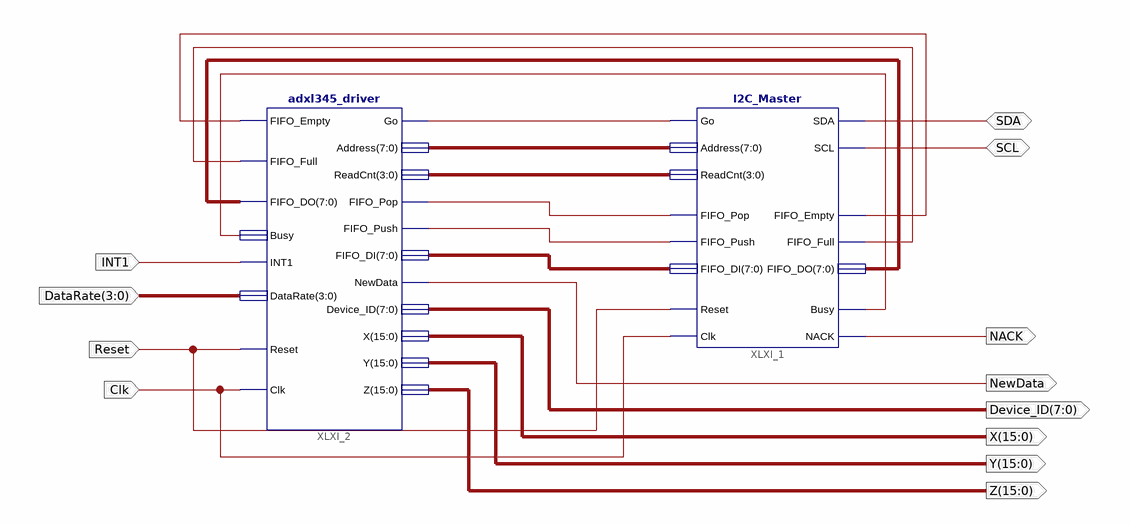
[diagram p0: schematic sheet 1]
// Xilinx ISE schematic adxl345_i2c.sch (spartan3e) as structural Verilog: 2 symbols, 12 ports
module adxl345_i2c (
  input  [3:0] DataRate,
  input  Reset,
  input  Clk,
  input  INT1,
  inout  SDA,
  inout  SCL,
  output NACK,
  output NewData,
  output [7:0] Device_ID,
  output [15:0] X,
  output [15:0] Y,
  output [15:0] Z
);

  wire XLXN_1, XLXN_41, XLXN_42, XLXN_63, XLXN_74, XLXN_75;
  wire [3:0] XLXN_40;
  wire [7:0] XLXN_39, XLXN_43, XLXN_76;

  I2C_Master XLXI_1 (
    .Go(XLXN_1), .Address(XLXN_39), .ReadCnt(XLXN_40), .SDA(SDA), .SCL(SCL), .FIFO_Pop(XLXN_41),
    .FIFO_Push(XLXN_42), .FIFO_DI(XLXN_43), .FIFO_Empty(XLXN_74), .FIFO_Full(XLXN_75), .FIFO_DO(XLXN_76),
    .Reset(Reset), .Clk(Clk), .Busy(XLXN_63), .NACK(NACK));
  adxl345_driver XLXI_2 (
    .FIFO_Empty(XLXN_74), .FIFO_Full(XLXN_75), .Busy(XLXN_63), .Reset(Reset), .Clk(Clk), .FIFO_DO(XLXN_76),
    .DataRate(DataRate), .Go(XLXN_1), .FIFO_Pop(XLXN_41), .FIFO_Push(XLXN_42), .NewData(NewData),
    .Address(XLXN_39), .ReadCnt(XLXN_40), .FIFO_DI(XLXN_43), .Device_ID(Device_ID), .X(X), .Y(Y), .Z(Z),
    .INT1(INT1));
endmodule
